# Altium schematic sheet MicroController.SchDoc
size 680 x 279 mm; SheetNumber: 2; SheetTotal: 11
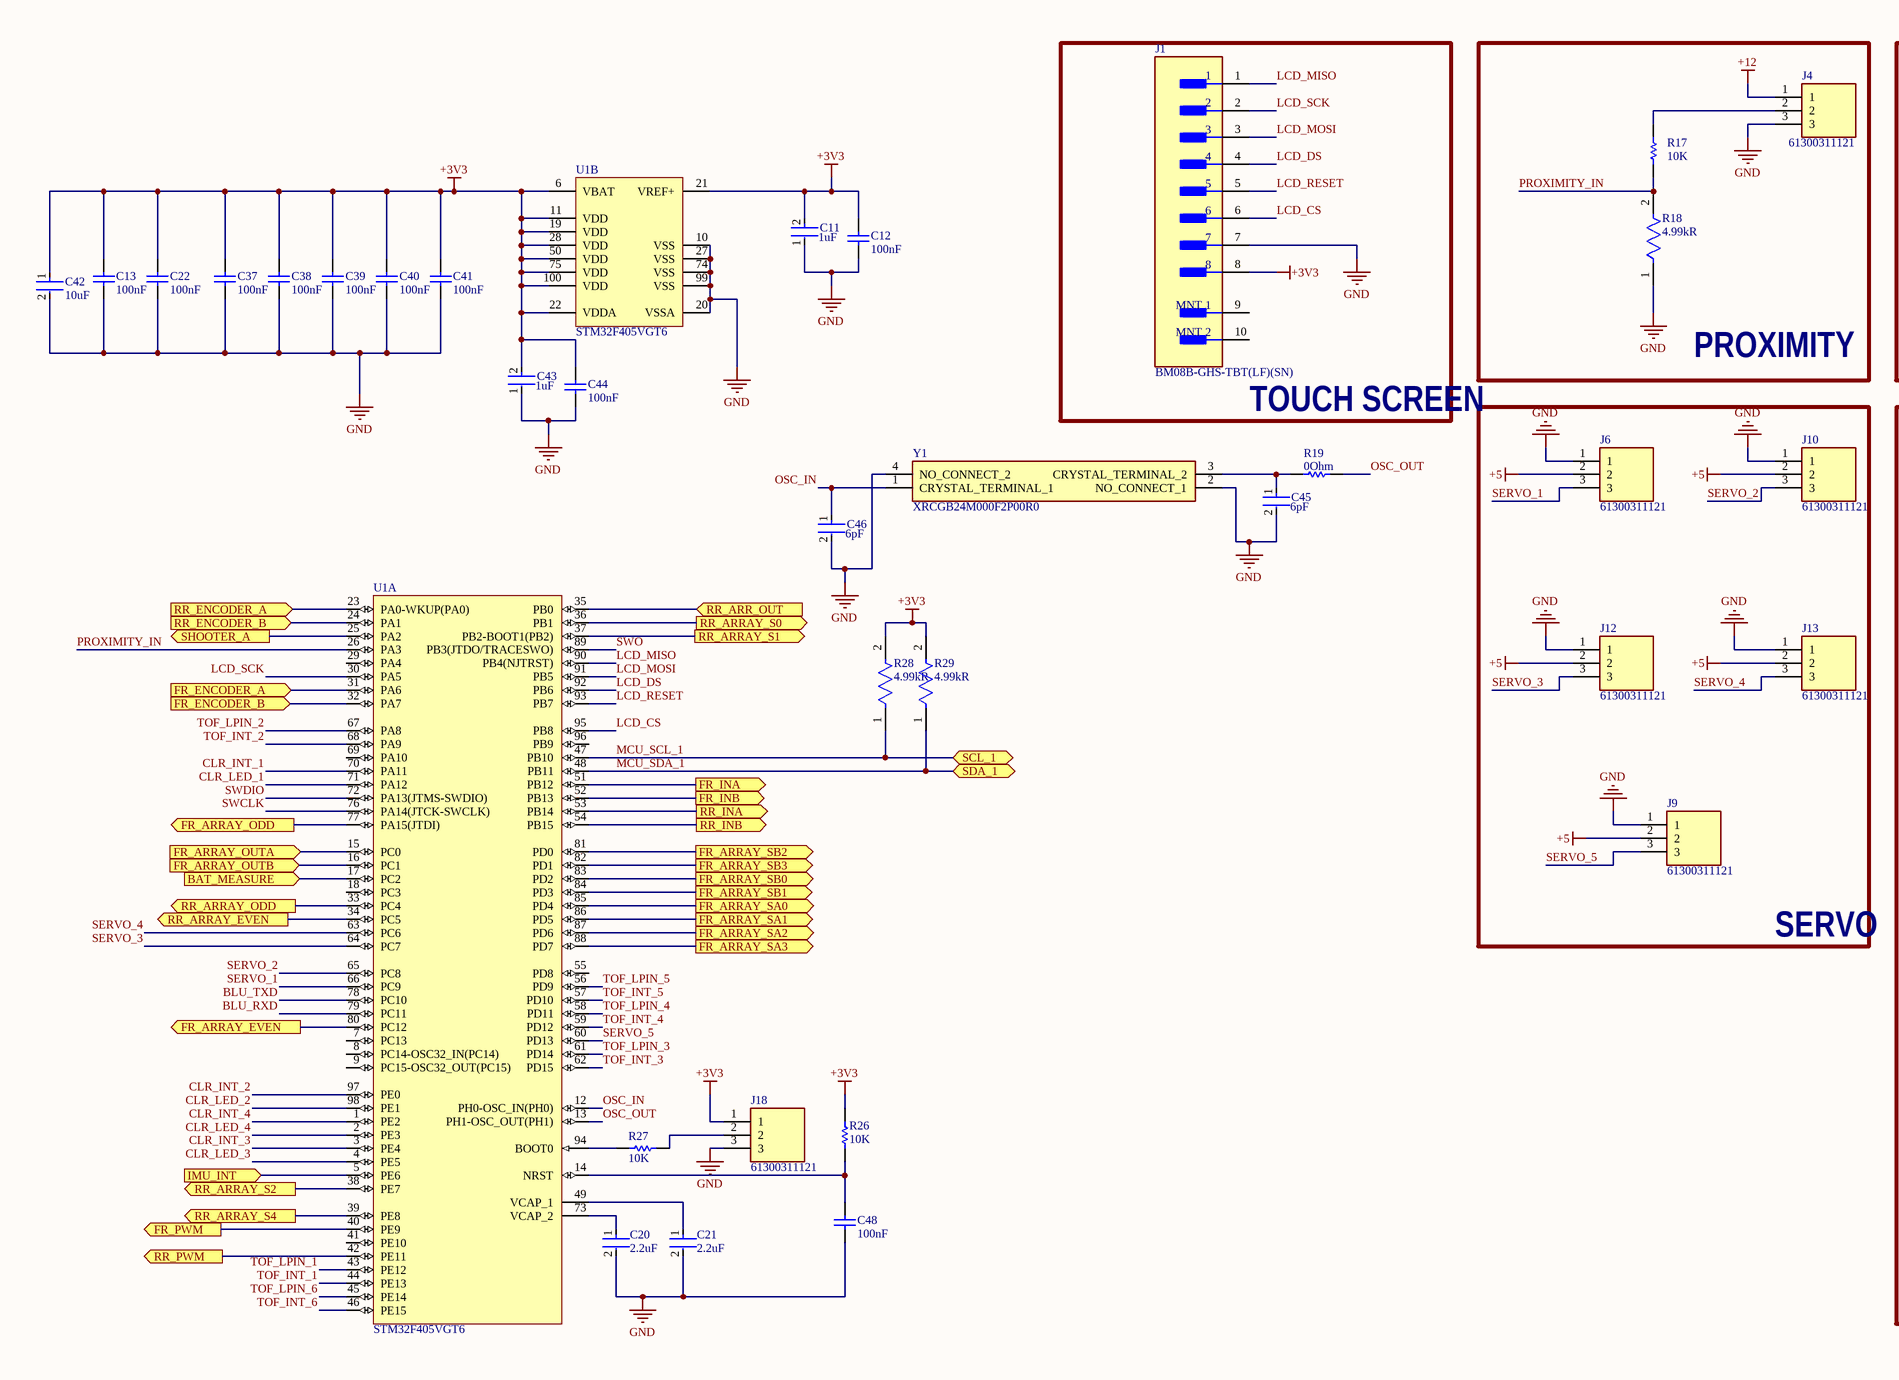
[diagram p0: MicroController.SchDoc, left]
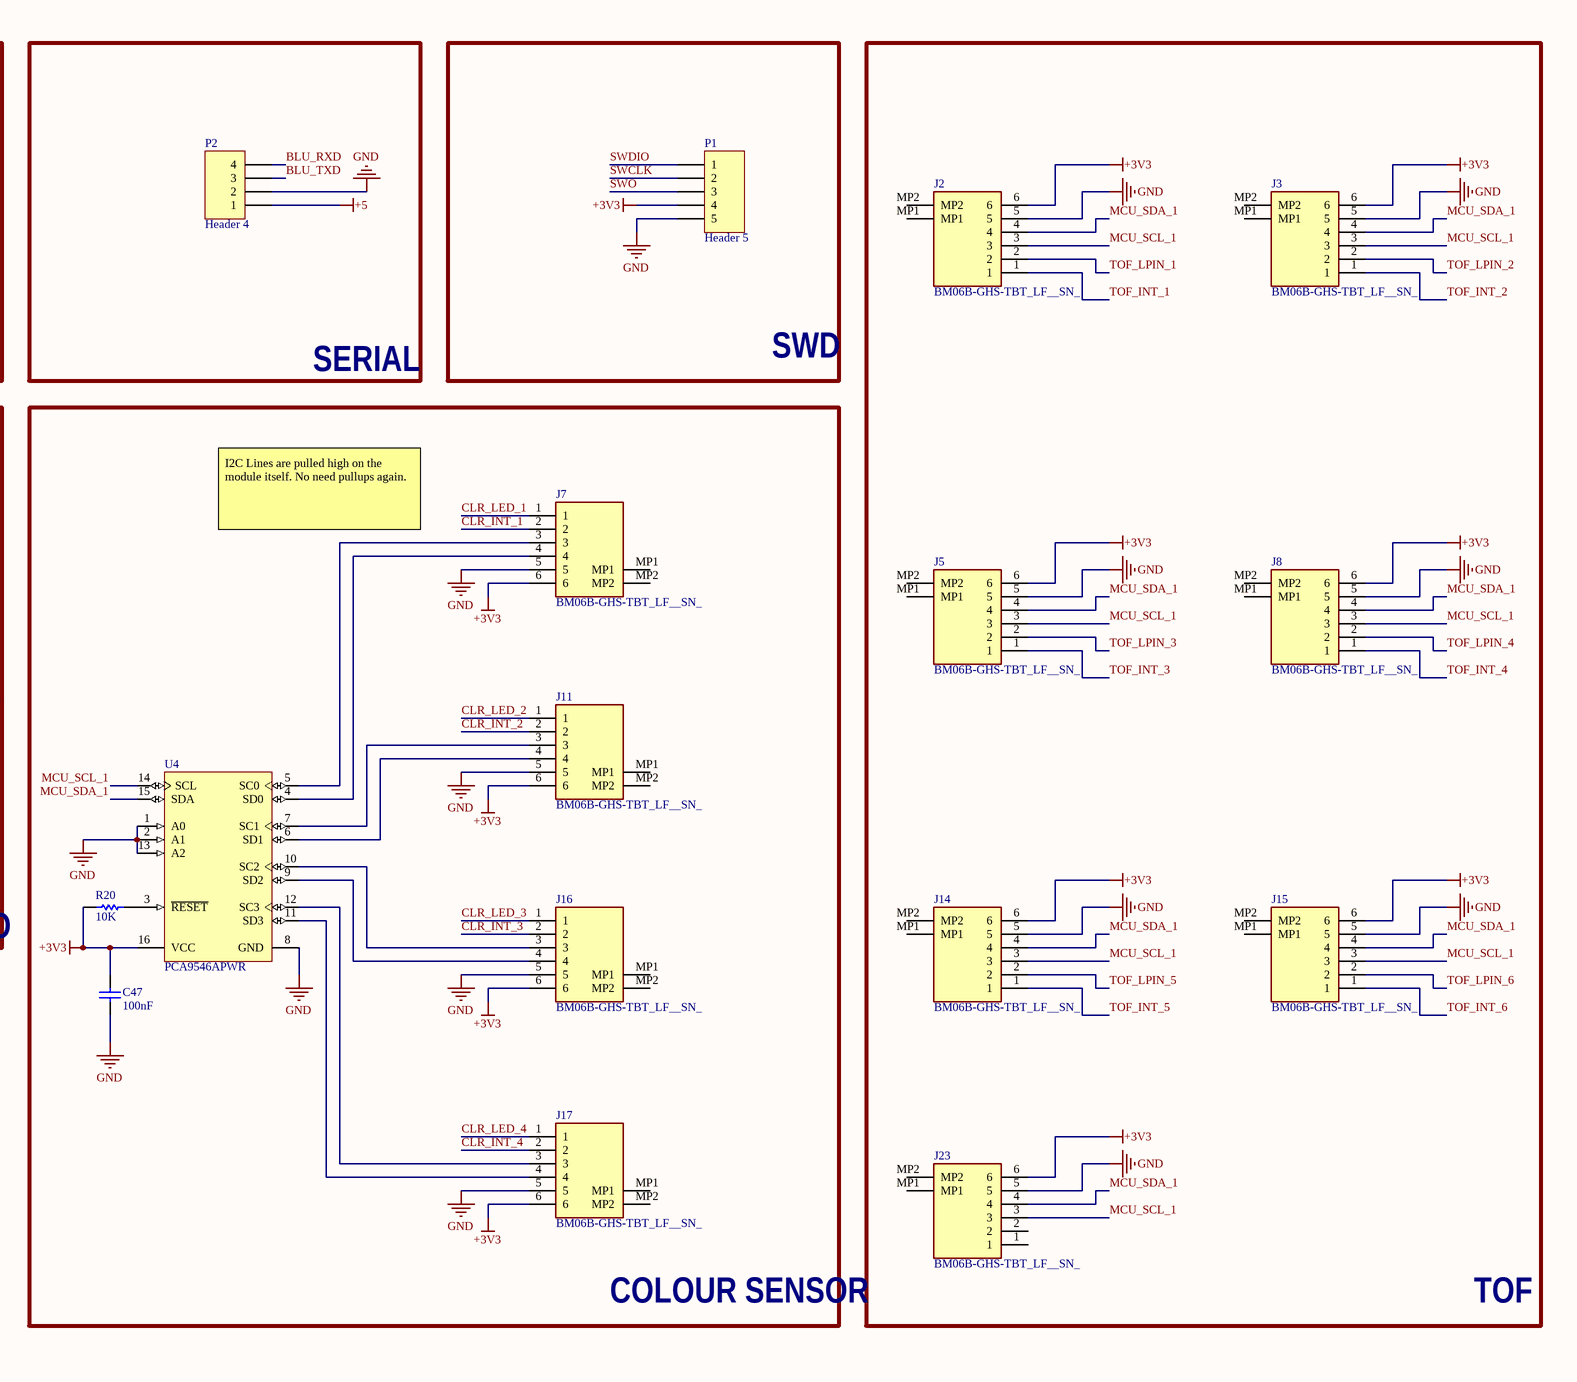
[diagram p1: MicroController.SchDoc, right]

## Parts
C11  Capacitance: 1uF  [FP-C1608-080-0_1-IPC_B]  (hidden comment: C1608X5R1H105K080AB)
C12  Capacitance: 100nF  [CAPC1050X55X23ML05T13]  (hidden comment: CL05B104KO5NNNC)
C13  Capacitance: 100nF  [CAPC1050X55X23ML05T13]  (hidden comment: CL05B104KO5NNNC)
C20  Capacitance: 2.2uF  [FP-GRM155-0_05-MFG]  (hidden comment: GRM155R61A225KE95D)
C21  Capacitance: 2.2uF  [FP-GRM155-0_05-MFG]  (hidden comment: GRM155R61A225KE95D)
C22  Capacitance: 100nF  [CAPC1050X55X23ML05T13]  (hidden comment: CL05B104KO5NNNC)
C37  Capacitance: 100nF  [CAPC1050X55X23ML05T13]  (hidden comment: CL05B104KO5NNNC)
C38  Capacitance: 100nF  [CAPC1050X55X23ML05T13]  (hidden comment: CL05B104KO5NNNC)
C39  Capacitance: 100nF  [CAPC1050X55X23ML05T13]  (hidden comment: CL05B104KO5NNNC)
C40  Capacitance: 100nF  [CAPC1050X55X23ML05T13]  (hidden comment: CL05B104KO5NNNC)
C41  Capacitance: 100nF  [CAPC1050X55X23ML05T13]  (hidden comment: CL05B104KO5NNNC)
C42  Capacitance: 10uF  [FP-CL05A106MP5NUNC-MFG]  (hidden comment: CL05A106MP5NUNC)
C43  Capacitance: 1uF  [FP-C1608-080-0_1-IPC_B]  (hidden comment: C1608X5R1H105K080AB)
C44  Capacitance: 100nF  [CAPC1050X55X23ML05T13]  (hidden comment: CL05B104KO5NNNC)
C45  value 6pF  [FP-GRT155-0_05-MFG]  (hidden comment: GRT1555C1H6R0DA02D)
C46  value 6pF  [FP-GRT155-0_05-MFG]  (hidden comment: GRT1555C1H6R0DA02D)
C47  Capacitance: 100nF  [CAPC1050X55X23ML05T13]  (hidden comment: CL05B104KO5NNNC)
C48  Capacitance: 100nF  [CAPC1050X55X23ML05T13]  (hidden comment: CL05B104KO5NNNC)
J1  BM08B-GHS-TBT(LF)(SN)  [FP-BM08B-GHS-TBT_LF_SN-MFG]
J2  BM06B-GHS-TBT_LF__SN_  [BM06BGHSTBTLFSN]
J3  BM06B-GHS-TBT_LF__SN_  [BM06BGHSTBTLFSN]
J4  61300311121  [HDRV3W64P0X254_1X3_762X254X869P]
J5  BM06B-GHS-TBT_LF__SN_  [BM06BGHSTBTLFSN]
J6  61300311121  [HDRV3W64P0X254_1X3_762X254X869P]
J7  BM06B-GHS-TBT_LF__SN_  [BM06BGHSTBTLFSN]
J8  BM06B-GHS-TBT_LF__SN_  [BM06BGHSTBTLFSN]
J9  61300311121  [HDRV3W64P0X254_1X3_762X254X869P]
J10  61300311121  [HDRV3W64P0X254_1X3_762X254X869P]
J11  BM06B-GHS-TBT_LF__SN_  [BM06BGHSTBTLFSN]
J12  61300311121  [HDRV3W64P0X254_1X3_762X254X869P]
J13  61300311121  [HDRV3W64P0X254_1X3_762X254X869P]
J14  BM06B-GHS-TBT_LF__SN_  [BM06BGHSTBTLFSN]
J15  BM06B-GHS-TBT_LF__SN_  [BM06BGHSTBTLFSN]
J16  BM06B-GHS-TBT_LF__SN_  [BM06BGHSTBTLFSN]
J17  BM06B-GHS-TBT_LF__SN_  [BM06BGHSTBTLFSN]
J18  61300311121  [HDRV3W64P0X254_1X3_762X254X869P]
J23  BM06B-GHS-TBT_LF__SN_  [BM06BGHSTBTLFSN]
P1  Header 5  [HDR1X5]
P2  Header 4  [HDR1X4]
R17  Resistance: 10K  [RESC1005X40X25LL05T10]  (hidden comment: RC0402FR-0710KL)
R18  Resistance: 4.99kR  [FP-CRCW0402-e3-MFG]  (hidden comment: CRCW04024K99FKED)
R19  value 0Ohm  [RESC1005X40X25NL05T10]  (hidden comment: RC0402JR-070RL)
R20  Resistance: 10K  [RESC1005X40X25LL05T10]  (hidden comment: RC0402FR-0710KL)
R26  Resistance: 10K  [RESC1005X40X25LL05T10]  (hidden comment: RC0402FR-0710KL)
R27  Resistance: 10K  [RESC1005X40X25LL05T10]  (hidden comment: RC0402FR-0710KL)
R28  Resistance: 4.99kR  [FP-CRCW0402-e3-MFG]  (hidden comment: CRCW04024K99FKED)
R29  Resistance: 4.99kR  [FP-CRCW0402-e3-MFG]  (hidden comment: CRCW04024K99FKED)
U1  STM32F405VGT6  [STM-LQFP100_V]  (parts A,B of 2)
U4  PCA9546APWR  [PW0016A_N]
Y1  XRCGB24M000F2P00R0  [XRCGB24M000F2P00R0]

## Blocks framed on the sheet
TOUCH SCREEN: J1
PROXIMITY: J4 R17 R18
SERIAL: P2
SWD: P1
TOF: J2 J3 J5 J8 J14 J15 J23
SERVO: J6 J9 J10 J12 J13
COLOUR SENSOR: C47 J7 J11 J16 J17 R20 U4

## Ports
BAT_MEASURE (in, see Main[3B], Power[1B]), FR_ARRAY_EVEN (out, see Main[4B], FrontIrArray[1B]), FR_ARRAY_ODD (out, see Main[4B], FrontIrArray[2B]), FR_ARRAY_OUTA (in, see Main[3B], FrontIrArray[2A]), FR_ARRAY_OUTB (in, see Main[3B], FrontIrArray[2B]), FR_ARRAY_SA0 (out, see Main[3B], FrontIrArray[2B]), FR_ARRAY_SA1 (out, see Main[3B], FrontIrArray[2B]), FR_ARRAY_SA2 (out, see Main[3B], FrontIrArray[4B]), FR_ARRAY_SA3 (out, see Main[3B], FrontIrArray[4B]), FR_ARRAY_SB0 (out, see Main[3B], FrontIrArray[2C]), FR_ARRAY_SB1 (out, see Main[3B], FrontIrArray[2C]), FR_ARRAY_SB2 (out, see Main[4B], FrontIrArray[4C]), FR_ARRAY_SB3 (out, see Main[4B], FrontIrArray[4C]), FR_ENCODER_A (in, see Main[4B], MotorController[4B]), FR_ENCODER_B (in, see Main[4B], MotorController[4B]), FR_INA (out, see Main[4B], MotorController[1B]), FR_INB (out, see Main[4C], MotorController[1B]), FR_PWM (out, see Main[4C], MotorController[1B]), IMU_INT (in, see Main[3C], IMU Unit[3B]), RR_ARR_OUT (in, see Main[3C], RrIrArray[3B]), RR_ARRAY_EVEN (out, see Main[4C], RrIrArray[2B]), RR_ARRAY_ODD (out, see Main[4C], RrIrArray[1B]), RR_ARRAY_S0 (out, see Main[3C], RrIrArray[3B]), RR_ARRAY_S1 (out, see Main[3C], RrIrArray[3B]), RR_ARRAY_S2 (out, see Main[3C], RrIrArray[4B]), RR_ARRAY_S4 (out, see Main[3C], RrIrArray[4B]), RR_ENCODER_A (in, see Main[4B], MotorController[4C]), RR_ENCODER_B (in, see Main[4B], MotorController[4C]), RR_INA (out, see Main[4C], MotorController[1B]), RR_INB (out, see Main[4C], MotorController[1B]), RR_PWM (out, see Main[4C], MotorController[1B]), SCL_1 (bidir, see Main[3C]), SDA_1 (bidir, see Main[3C]), SHOOTER_A (out, see Main[4B], Shooter[3B])

## Nets
+3V3: C11.2 C12.1 C13.1 C22.1 C37.1 C38.1 C39.1 C40.1 C41.1 C42.1 C43.2 C44.1 C47.1 J1.8 J2.6 J3.6 J5.6 J7.6 J8.6 J11.6 J14.6 J15.6 J16.6 J17.6 J18.1 J23.6 P1.4 R20.2 R26.1 R28.2 R29.2 U1.6(VBAT) U1.11(VDD) U1.19(VDD) U1.21(VREF+) U1.22(VDDA) U1.28(VDD) U1.50(VDD) U1.75(VDD) U1.100(VDD) U4.16(VCC)
+5: J6.2 J9.2 J10.2 J12.2 J13.2 P2.1
+12: J4.1
GND: C11.1 C12.2 C13.2 C20.2 C21.2 C22.2 C37.2 C38.2 C39.2 C40.2 C41.2 C42.2 C43.1 C44.2 C45.2 C46.2 C47.2 C48.2 J1.7 J2.5 J3.5 J4.3 J5.5 J6.1 J7.5 J8.5 J9.1 J10.1 J11.5 J12.1 J13.1 J14.5 J15.5 J16.5 J17.5 J18.3 J23.5 P1.5 P2.2 R18.1 U1.10(VSS) U1.20(VSSA) U1.27(VSS) U1.74(VSS) U1.99(VSS) U4.1(A0) U4.2(A1) U4.8(GND) U4.13(A2) Y1.2(NO_CONNECT_1) Y1.4(NO_CONNECT_2)
BAT_MEASURE: U1.17(PC2) ; port BAT_MEASURE
BLU_RXD: P2.4 U1.79(PC11)
BLU_TXD: P2.3 U1.78(PC10)
CLR_INT_1: J7.2 U1.70(PA11)
CLR_INT_2: J11.2 U1.97(PE0)
CLR_INT_3: J16.2 U1.3(PE4)
CLR_INT_4: J17.2 U1.1(PE2)
CLR_LED_1: J7.1 U1.71(PA12)
CLR_LED_2: J11.1 U1.98(PE1)
CLR_LED_3: J16.1 U1.4(PE5)
CLR_LED_4: J17.1 U1.2(PE3)
FR_ARRAY_EVEN: U1.80(PC12) ; port FR_ARRAY_EVEN
FR_ARRAY_ODD: U1.77(PA15(JTDI)) ; port FR_ARRAY_ODD
FR_ARRAY_OUTA: U1.15(PC0) ; port FR_ARRAY_OUTA
FR_ARRAY_OUTB: U1.16(PC1) ; port FR_ARRAY_OUTB
FR_ARRAY_SA0: U1.85(PD4) ; port FR_ARRAY_SA0
FR_ARRAY_SA1: U1.86(PD5) ; port FR_ARRAY_SA1
FR_ARRAY_SA2: U1.87(PD6) ; port FR_ARRAY_SA2
FR_ARRAY_SA3: U1.88(PD7) ; port FR_ARRAY_SA3
FR_ARRAY_SB0: U1.83(PD2) ; port FR_ARRAY_SB0
FR_ARRAY_SB1: U1.84(PD3) ; port FR_ARRAY_SB1
FR_ARRAY_SB2: U1.81(PD0) ; port FR_ARRAY_SB2
FR_ARRAY_SB3: U1.82(PD1) ; port FR_ARRAY_SB3
FR_ENCODER_A: U1.31(PA6) ; port FR_ENCODER_A
FR_ENCODER_B: U1.32(PA7) ; port FR_ENCODER_B
FR_INA: U1.51(PB12) ; port FR_INA
FR_INB: U1.52(PB13) ; port FR_INB
FR_PWM: U1.40(PE9) ; port FR_PWM
IMU_INT: U1.5(PE6) ; port IMU_INT
LCD_CS: J1.6 U1.95(PB8)
LCD_DS: J1.4 U1.92(PB6)
LCD_MISO: J1.1 U1.90(PB4(NJTRST))
LCD_MOSI: J1.3 U1.91(PB5)
LCD_RESET: J1.5 U1.93(PB7)
LCD_SCK: J1.2 U1.30(PA5)
MCU_SCL_1: J2.3 J3.3 J5.3 J8.3 J14.3 J15.3 J23.3 R28.1 U1.47(PB10) U4.14(SCL) ; port SCL_1
MCU_SDA_1: J2.4 J3.4 J5.4 J8.4 J14.4 J15.4 J23.4 R29.1 U1.48(PB11) U4.15(SDA) ; port SDA_1
OSC_IN: C46.1 U1.12(PH0-OSC_IN(PH0)) Y1.1(CRYSTAL_TERMINAL_1)
OSC_OUT: R19.2 U1.13(PH1-OSC_OUT(PH1))
PROXIMITY_IN: R17.1 R18.2 U1.26(PA3)
RR_ARR_OUT: U1.35(PB0) ; port RR_ARR_OUT
RR_ARRAY_EVEN: U1.34(PC5) ; port RR_ARRAY_EVEN
RR_ARRAY_ODD: U1.33(PC4) ; port RR_ARRAY_ODD
RR_ARRAY_S0: U1.36(PB1) ; port RR_ARRAY_S0
RR_ARRAY_S1: U1.37(PB2-BOOT1(PB2)) ; port RR_ARRAY_S1
RR_ARRAY_S2: U1.38(PE7) ; port RR_ARRAY_S2
RR_ARRAY_S4: U1.39(PE8) ; port RR_ARRAY_S4
RR_ENCODER_A: U1.23(PA0-WKUP(PA0)) ; port RR_ENCODER_A
RR_ENCODER_B: U1.24(PA1) ; port RR_ENCODER_B
RR_INA: U1.53(PB14) ; port RR_INA
RR_INB: U1.54(PB15) ; port RR_INB
RR_PWM: U1.42(PE11) ; port RR_PWM
SERVO_1: J6.3 U1.66(PC9)
SERVO_2: J10.3 U1.65(PC8)
SERVO_3: J12.3 U1.64(PC7)
SERVO_4: J13.3 U1.63(PC6)
SERVO_5: J9.3 U1.60(PD13)
SHOOTER_A: U1.25(PA2) ; port SHOOTER_A
SWCLK: P1.2 U1.76(PA14(JTCK-SWCLK))
SWDIO: P1.1 U1.72(PA13(JTMS-SWDIO))
SWO: P1.3 U1.89(PB3(JTDO/TRACESWO))
TOF_INT_1: J2.1 U1.44(PE13)
TOF_INT_2: J3.1 U1.68(PA9)
TOF_INT_3: J5.1 U1.62(PD15)
TOF_INT_4: J8.1 U1.59(PD12)
TOF_INT_5: J14.1 U1.57(PD10)
TOF_INT_6: J15.1 U1.46(PE15)
TOF_LPIN_1: J2.2 U1.43(PE12)
TOF_LPIN_2: J3.2 U1.67(PA8)
TOF_LPIN_3: J5.2 U1.61(PD14)
TOF_LPIN_4: J8.2 U1.58(PD11)
TOF_LPIN_5: J14.2 U1.56(PD9)
TOF_LPIN_6: J15.2 U1.45(PE14)
NetC20_1: C20.1 U1.73(VCAP_2)
NetC21_1: C21.1 U1.49(VCAP_1)
NetC45_1: C45.1 R19.1 Y1.3(CRYSTAL_TERMINAL_2)
NetC48_1: C48.1 R26.2 U1.14(NRST)
NetJ4_2: J4.2 R17.2
NetJ7_3: J7.3 U4.5(SC0)
NetJ7_4: J7.4 U4.4(SD0)
NetJ11_3: J11.3 U4.7(SC1)
NetJ11_4: J11.4 U4.6(SD1)
NetJ16_3: J16.3 U4.10(SC2)
NetJ16_4: J16.4 U4.9(SD2)
NetJ17_3: J17.3 U4.12(SC3)
NetJ17_4: J17.4 U4.11(SD3)
NetJ18_2: J18.2 R27.1
NetR20_1: R20.1 U4.3(~{RESET})
NetR27_2: R27.2 U1.94(BOOT0)

Not connected (* = marked no-connect by the designer): J1 9(MNT_1) 10(MNT_2); J2 MP1 MP2; J3 MP1 MP2; J5 MP1 MP2; J7 MP1 MP2; J8 MP1 MP2; J11 MP1 MP2; J14 MP1 MP2; J15 MP1 MP2; J16 MP1 MP2; J17 MP1 MP2; J23 1 2 MP1 MP2; U1 7(PC13) 8(PC14-OSC32_IN(PC14)) 9(PC15-OSC32_OUT(PC15)) 18(PC3) 29(PA4) 41(PE10) 55(PD8) 69(PA10) 96(PB9)

## Notes on the sheet
- I2C Lines are pulled high on the module itself. No need pullups again.

## Library data of the parts
C11 C43 = CMP-2000-06025-2: Multilayer Ceramic Capacitors 1μF ±10% 50V X5R SMD 0603; Lead Free: Lead Free; Height: 0.8mm; Mount: Surface Mount; Radiation Hardening: No; Thickness: 0.035inch; Length: 1.6mm; Max Operating Temperature: 85°C; REACH SVHC: No SVHC; Min Operating Temperature: -55°C; Construction: Flat; RoHS Compliant: Yes; Voltage Rating: 50V; Dielectric: X5R; Packaging: Tape and Reel; Termination: SMD/SMT; Voltage Rating (DC): 50V; Case Code (Imperial): 0603; Voltage: 50V; Width: 0.031inch; Weight: 7.1E-05oz; Depth: 0.8mm; Case Code (Metric): 1608; Series: C; Case/Package: 0603; Tolerance: 10%; Resistor Type: Ceramic; Number of Pins: 2; Dielectric Material: Ceramic; Package Quantity: 1
C12 C13 C22 C37-C41 C44 C47 C48 = CMP-2000-05439-1: Chip Capacitor, 100 nF, +/- 10%, 16 V, -55 to 125 degC, 0402 (1005 Metric), RoHS, Tape and Reel; Manufacturer: Samsung Electro-Mechanics; Dielectric: X7R; Rated Voltage: 16V; Case Size/Dimension: 0402; Tolerance (%): ±10%; Manufacturer URL: http://www.samsungsem.com/global/index.jsp; Datasheet URL: https://datasheet.ciiva.com/29198/458718-da-01-en-vs-kondensator-0402-29198423.pdf; Datasheet Version: Nov-10
C20 C21 = CMP-06035-063009-1: CAP CER 2.2UF 10V X5R 0402; Material: Ceramic; Tolerance: 10%; Max Operating Temperature: 85°C; Min Operating Temperature: -55°C; Weight: 0.000212oz; Lead Free: Lead Free; Case Code (Imperial): 0402; Case Code (Metric): 1005; Length: 1mm; Packaging: Tape and Reel; Depth: 0.5mm; Voltage Rating: 10V; REACH SVHC: No SVHC; Width: 0.5mm; Case/Package: 0402; RoHS Compliant: Yes; Termination: SMD/SMT; Voltage Rating (DC): 10V; Height: 0.5mm; Mount: Surface Mount; Package Quantity: 10000; Dielectric: X5R; Thickness: 0.022inch
C42 = CMP-13271-000002-1: CAP CER 10UF 10V X5R 0402; Manufacturer: Samsung; Temperature Coefficient: 15%; Tolerance: 20%; Material: Ceramic; Octopart: https://octopart.com/cl05a106mp5nunc-samsung-22457395; Voltage Rating: 10V; RoHS: TRUE; Value: 10uF; Height: 0.7mm; Digikey Description: CAP CER 10UF 10V X5R 0402; Automotive: No; Package: CL05A106MP5NUNC; Device Class L1: Passive Components; Temperature Range High: +85°C; ComponentLink2Description: Datasheet; Device Class L2: Capacitors; Temperature Characteristic: X5R; Manufacturer Part Number: CL05A106MP5NUNC; Temperature: -55°C to +85°C; ComponentLink2URL: http://www.samsungsem.com/kr/support/product-search/mlcc/__icsFiles/afieldfile/2019/05/10/19-CL05A106MP5NUNC.pdf; Device Class L3: Ceramic Capacitors; Category: Cap; Temperature Range Low: -55°C; Ipc Land Pattern Name: CAPC10050X50; Lead Free: Yes
C45 C46 = CMP-06035-048499-1: Multi-Layer Ceramic Capacitor 6pF 50V C0G ±0.5pF 0402 Paper T/R
J1 = CMP-17439-000100-1: CONN HEADER SMD 8POS 1.25MM; Number of Positions: 8; Voltage Rating (AC): 50V; Wire/Cable Gauge: 26AWG; Current Rating: 1A; Lead Free: Lead Free; Max Operating Temperature: 85°C; Contact Material: Bronze; Housing Material: Nylon; Number of Rows: 1; Orientation: Straight; Packaging: Cut Tape; Contact Plating: Tin; Housing Color: Natural; REACH SVHC: No SVHC; Min Operating Temperature: -25°C; Series: GH; Voltage Rating: 50V; Pitch: 1.25mm; Number of Contacts: 8; Case/Package: SMD/SMT; Termination: SMD/SMT
J2 J3 J5 J7 J8 J11 J14-J17 J23 = BM06B-GHS-TBT_LF__SN_: Connector; Manufacturer_Name: JST (JAPAN SOLDERLESS TERMINALS); Manufacturer_Part_Number: BM06B-GHS-TBT(LF)(SN); Datasheet Link: https://datasheet.lcsc.com/szlcsc/2004111131_JST-Sales-America-BM06B-GHS-TBT-LF-SN_C495534.pdf; Height: 4.05mm
  J5: Supplier 1: LCSC; Supplier Part Number 1: C189892
J4 J6 J9 J10 J12 J13 J18 = 61300311121: Connector; Manufacturer_Name: Wurth Elektronik; Datasheet Link: http://katalog.we-online.de/em/datasheet/6130xx11121.pdf; Height: 8.69mm; Manufacturer_Part_Number: 61300311121; Mouser Part Number: 710-61300311121; Mouser Price/Stock: https://www.mouser.co.uk/ProductDetail/Wurth-Elektronik/61300311121?qs=PhR8RmCirEYxRWFJzNKsUw%3D%3D
P1 = Header 5: Header, 5-Pin; LatestRevisionDate: 17-Jul-2002; LatestRevisionNote: Re-released for DXP Platform.; Publisher: Altium Limited
P2 = Header 4: Header, 4-Pin; LatestRevisionDate: 17-Jul-2002; LatestRevisionNote: Re-released for DXP Platform.; Publisher: Altium Limited
R17 R20 R26 R27 = CMP-2002-07353-1: Manufacturer: Yageo / Phycomp; Part Number: RC0402FR-0710KL
R18 R28 R29 = CMP-2002-00057-2: RES Thick Film, 4.99kΩ, 1%, 0.063W, 100ppm/°C, 0402; Power Rating: 63mW; Voltage Rating: 50V; Package Quantity: 10; Max Power Dissipation: 63mW; Temperature Coefficient: 100ppm/°C; Lead Free: Lead Free; Mount: Surface Mount; Height: 0.35mm; Number of Terminations: 2; Contact Plating: Tin; Case/Package: 0402; Max Operating Temperature: 155°C; Case Code (Imperial): 0402; Weight: 2.3E-05oz; Width: 0.5mm; Features: Automotive AEC-Q200; Voltage Rating (DC): 50V; Tolerance: 1%; Min Operating Temperature: -55°C; Length: 1mm; Depth: 0.5mm; Military Standard: Not; Packaging: Tape and Reel; Radiation Hardening: No; Composition: Thick Film; Termination: SMD/SMT; Case Code (Metric): 1005
R19 = CMP-1011-00001-2: Manufacturer: Yageo / Phycomp; Part Number: RC0402JR-070RL
U1 = CMP-0243-00020-3: ARM Cortex-M4 32-bit MCU+FPU, 210 DMIPS, 1024 kB Flash, 192 kB Internal RAM, 82 I/Os, 100-pin LQFP, -40 to 85 degC, Tray; Manufacturer: STMicroelectronics; Operating Frequency(F) (Processor speed) (MHz): 168; Supply Voltage(Vcc) max (V): 3.6; D/A Converter: 2x12-bit; Internal RAM Size (kB): 192; Supply Voltage(Vcc) min (V): 1.8; I/Os (High Current): 82; FLASH Size (Prog) (kB): 1024; PackageDescription: 100-Pin Low Profile Quad Flat Package, 14 x 14 mm Body, 0.5 mm Pitch; PackageReference: LQFP100; PartNumber: STM32F405VGT6; ComponentLink1URL: http://www.st.com/web/en/home.html; ComponentLink2Description: Datasheet; ComponentLink3Description: Package Specification; Mounting Technology: Surface Mount; DatasheetVersion: Rev. 4; ComponentLink1Description: Manufacturer URL; PackageVersion: Rev. 1, 06/2013; ComponentLink2URL: http://www.st.com/st-web-ui/static/active/en/resource/technical/document/datasheet/DM00037051.pdf; ComponentLink3URL: http://www.st.com/st-web-ui/static/active/en/resource/technical/document/data_brief/DM00071938.pdf; Core: ARM Cortex-M4; Packing: Tray
U4 = CMP-0314-00274-2: 4-Channel I2C and SMBus Multiplexer with Reset Functions, 2.3 to 5.5 V, -40 to 85 degC, 16-pin TSSOP (PW), Green (RoHS & no Sb/Br); Manufacturer: Texas Instruments; Simultaneously Active Channels: 1 to 4; fSCLK(Max)(MHz): 100, 400; VCC(Max)(V): 5.5; tpd max(ns): 0.3, 1; 5V Tolerant I/O: Yes; SubFamily: I2C Multiplexer, Switch; Channel Width: 4; I2C Address: 1110 xxx; VCC(Min)(V): 2.3; Max Frequency(kHz): 400; Eco-Plan: Green (RoHS & no Sb/Br); ComponentLink1URL: http://www.ti.com/general/docs/lit/getliterature.tsp?genericPartNumber=PCA9546A&fileType=pdf; Code_JEDEC: MO-153; PackageDescription: 16-Pin Plastic Thin Small Outline Package 5 x 4.4 mm Body ,0.65 mm Pitch; PartNumber: PCA9546APWR; Reset Input: Yes; Mounting Technology: Surface Mount; Open Drain I/O Type: Yes; ComponentLink1Description: Datasheet; PackageReference: PW0016A; DatasheetVersion: SCPS148E; Vcc range(V): 2.3 to 5.5; PackageVersion: revG, Feb-2011
Y1 = XRCGB24M000F2P00R0: Crystal or Oscillator; Manufacturer_Name: Murata Electronics; Datasheet Link: https://www.murata.com/products/productdata/8801057734686/SPEC-XRCGB24M000F2P00R0.pdf; Height: 0.7mm; Manufacturer_Part_Number: XRCGB24M000F2P00R0; Mouser Part Number: 81-XRCGB24M000F2P0R0; Mouser Price/Stock: https://www.mouser.co.uk/ProductDetail/Murata-Electronics/XRCGB24M000F2P00R0?qs=gvhpkjpQEVQGHd411wA%252BwA%3D%3D; Arrow Part Number: XRCGB24M000F2P00R0; Arrow Price/Stock: https://www.arrow.com/en/products/xrcgb24m000f2p00r0/murata-manufacturing?region=nac